# EAGLE design CSB (EAGLE 5.11)
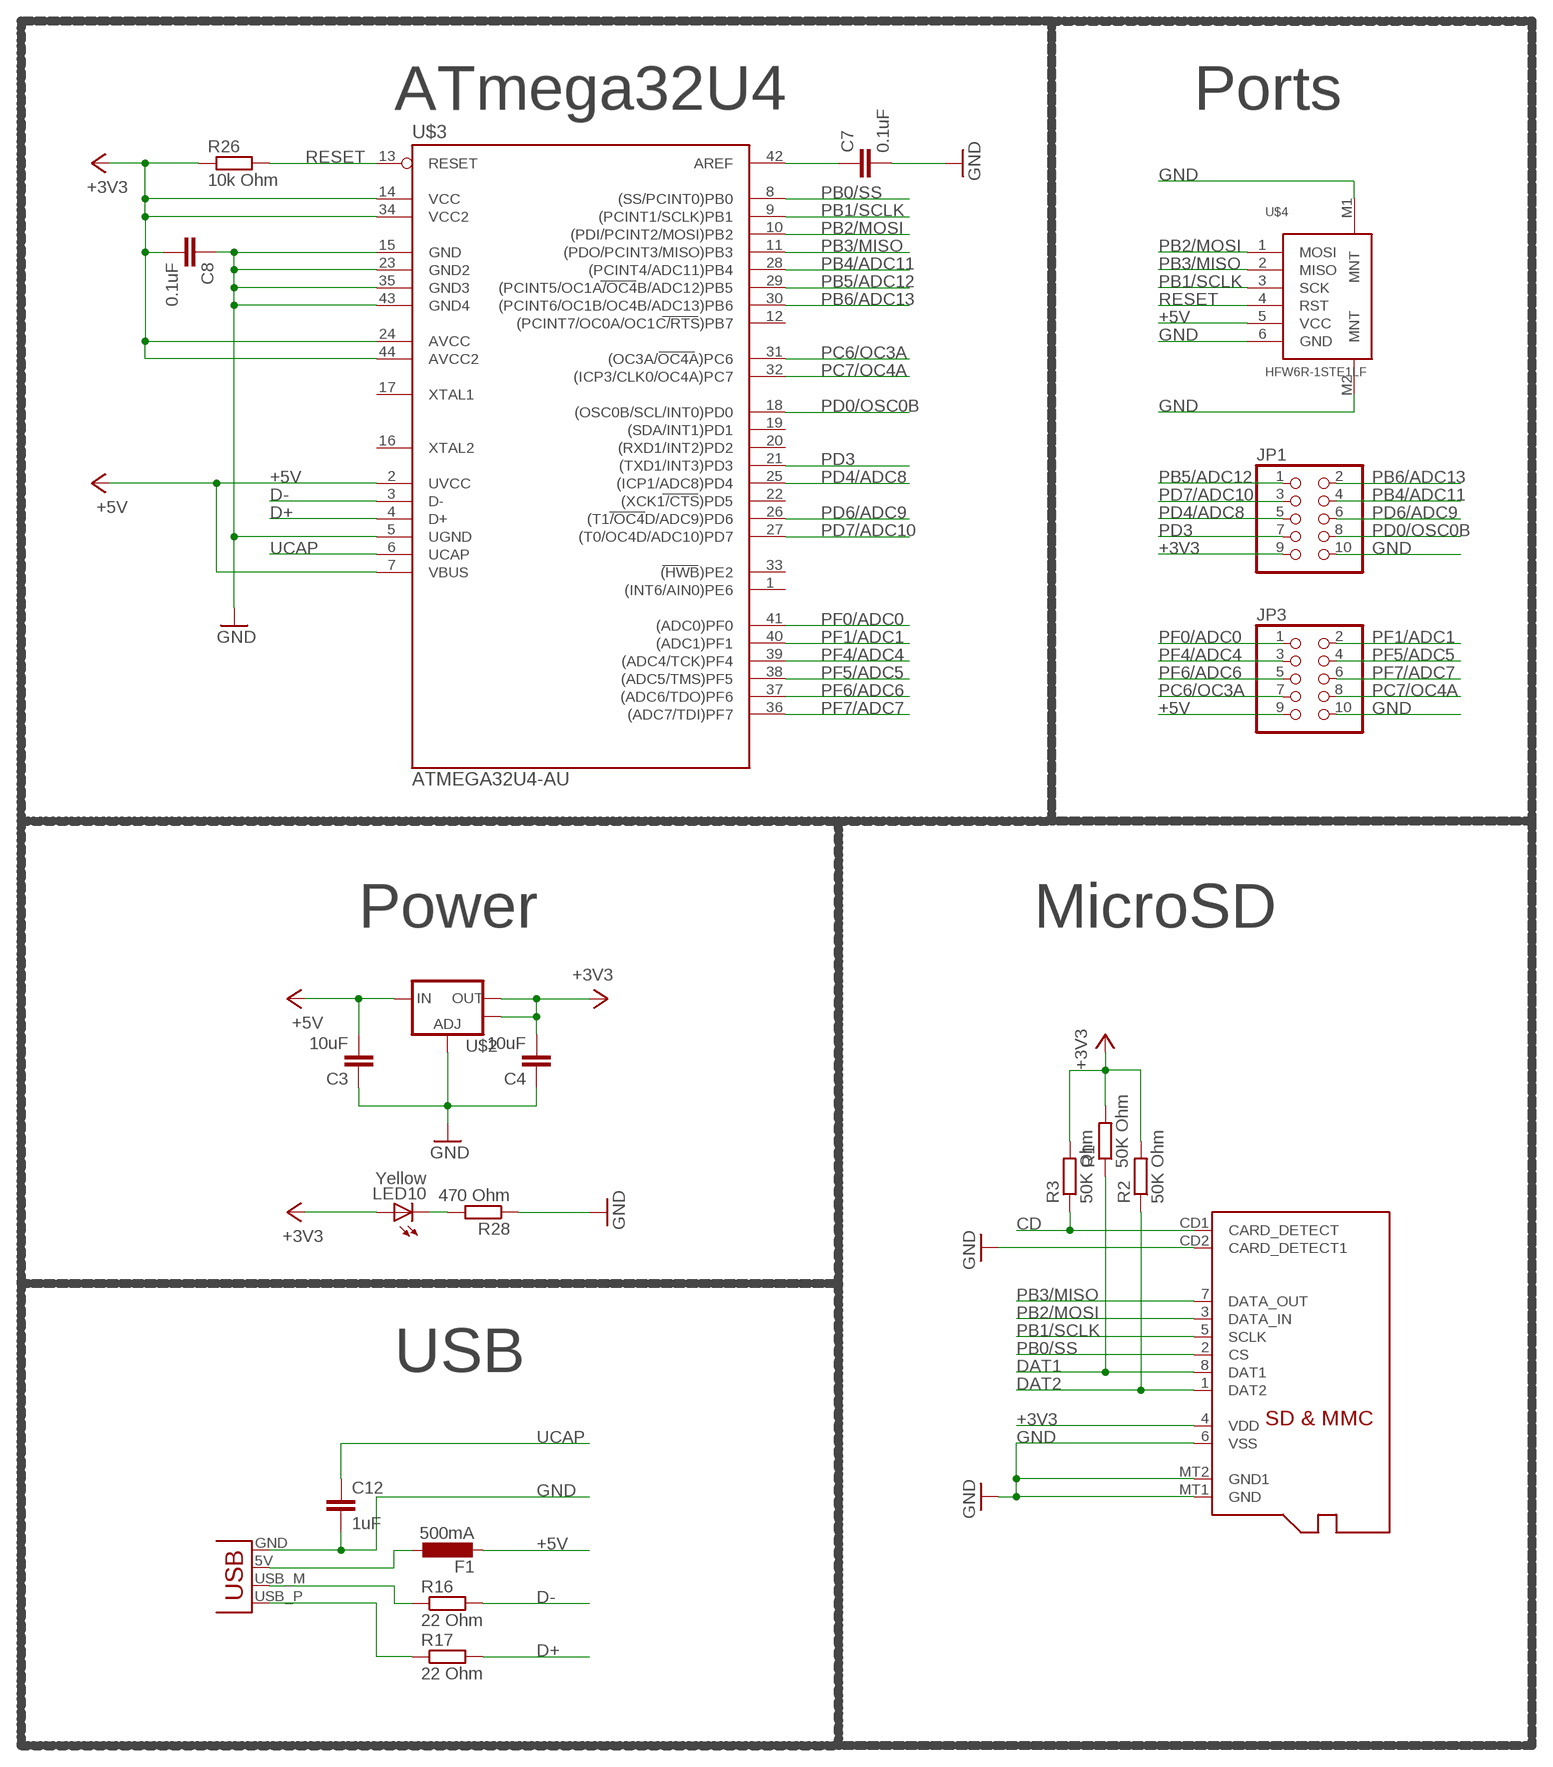
[diagram p0: schematic, sheet 1]

## Parts
C3  10uF  C-EUC0603  [C0603]
C4  10uF  C-EUC0603  [C0603]
C7  0.1uF  C-EUC0603  [C0603]
C8  0.1uF  C-EUC0603  [C0603]
C12  1uF  C-EUC0603  [C0603]
F1  500mA  L-EUL1812  [L1812]
JP1  PINHD-2X5  [2X05]
JP3  PINHD-2X5  [2X05]
LED10  Yellow  LEDCHIPLED_0603  [CHIPLED_0603]
R1  50K Ohm  R-EU_R0603  [R0603]
R2  50K Ohm  R-EU_R0603  [R0603]
R3  50K Ohm  R-EU_R0603  [R0603]
R16  22 Ohm  R-EU_R0603  [R0603]
R17  22 Ohm  R-EU_R0603  [R0603]
R26  10k Ohm  R-EU_R0603  [R0603]
R28  470 Ohm  R-EU_R0603  [R0603]
U$1  MICROSD  [MICROSD]
U$2  V_REG_317SMD  V_REG_LM1117SOT223  [SOT223]
U$3  ATMEGA32U4-AU  [TQFP44]
U$4  HFW6R-1STE1LF  [HFW6R-1STE1LF]
X1  USBPCB  [USB-A-PCB]

## Nets
+3V3: C4.2 C8.2 JP1.9 LED10.A R1.2 R2.2 R3.2 R26.1 U$1.4(VDD) U$2.2(OUT) U$2.4(OUT) U$3.14(VCC) U$3.24(AVCC) U$3.34(VCC2) U$3.44(AVCC2)
+5V: C3.2 F1.2 JP3.9 U$2.3(IN) U$3.2(UVCC) U$3.7(VBUS) U$4.5(VCC)
CD: R3.1 U$1.CD1(CARD_DETECT)
D+: R17.2 U$3.4(D+)
D-: R16.2 U$3.3(D-)
DAT1: R1.1 U$1.8(DAT1)
DAT2: R2.1 U$1.1(DAT2)
GND: C3.1 C4.1 C7.2 C8.1 C12.2 JP1.10 JP3.10 R28.1 U$1.6(VSS) U$1.CD2(CARD_DETECT1) U$1.MT1(GND) U$1.MT2(GND1) U$2.1(ADJ) U$3.5(UGND) U$3.15(GND) U$3.23(GND2) U$3.35(GND3) U$3.43(GND4) U$4.6(GND) U$4.M1(MNT) U$4.M2(MNT) X1.GND
N$5: C7.1 U$3.42(AREF)
N$59: LED10.C R28.2
PB0/SS: U$1.2(CS) U$3.8((SS/PCINT0)PB0)
PB1/SCLK: U$1.5(SCLK) U$3.9((PCINT1/SCLK)PB1) U$4.3(SCK)
PB2/MOSI: U$1.3(DATA_IN) U$3.10((PDI/PCINT2/MOSI)PB2) U$4.1(MOSI)
PB3/MISO: U$1.7(DATA_OUT) U$3.11((PDO/PCINT3/MISO)PB3) U$4.2(MISO)
PB4/ADC11: JP1.4 U$3.28((PCINT4/ADC11)PB4)
PB5/ADC12: JP1.1 U$3.29((PCINT5/OC1A/OC4B/ADC12)PB5)
PB6/ADC13: JP1.2 U$3.30((PCINT6/OC1B/OC4B/ADC13)PB6)
PC6/OC3A: JP3.7 U$3.31((OC3A/OC4A)PC6)
PC7/OC4A: JP3.8 U$3.32((ICP3/CLK0/OC4A)PC7)
PD0/OSC0B: JP1.8 U$3.18((OSC0B/SCL/INT0)PD0)
PD3: JP1.7 U$3.21((TXD1/INT3)PD3)
PD4/ADC8: JP1.5 U$3.25((ICP1/ADC8)PD4)
PD6/ADC9: JP1.6 U$3.26((T1/OC4D/ADC9)PD6)
PD7/ADC10: JP1.3 U$3.27((T0/OC4D/ADC10)PD7)
PF0/ADC0: JP3.1 U$3.41((ADC0)PF0)
PF1/ADC1: JP3.2 U$3.40((ADC1)PF1)
PF4/ADC4: JP3.3 U$3.39((ADC4/TCK)PF4)
PF5/ADC5: JP3.4 U$3.38((ADC5/TMS)PF5)
PF6/ADC6: JP3.5 U$3.37((ADC6/TDO)PF6)
PF7/ADC7: JP3.6 U$3.36((ADC7/TDI)PF7)
RD+: R17.1 X1.USB_P(D+)
RD-: R16.1 X1.USB_M(D-)
RESET: R26.2 U$3.13(RESET) U$4.4(RST)
UCAP: C12.1 U$3.6(UCAP)
VCCBUS: F1.1 X1.5V(VBUS)
Unconnected: U$3.1((INT6/AIN0)PE6) U$3.12((PCINT7/OC0A/OC1C/RTS)PB7) U$3.16(XTAL2) U$3.17(XTAL1) U$3.19((SDA/INT1)PD1) U$3.20((RXD1/INT2)PD2) U$3.22((XCK1/CTS)PD5) U$3.33((HWB)PE2)

## Notes on the sheet
- ATmega32U4 | Ports
- Power | MicroSD
- USB

## Library data of the parts
C3 C4 C7 C8 C12 = rcl:C-EU: CAPACITOR, European symbol
F1 = rcl:L-EU: INDUCTOR, European symbol
JP1 JP3 = pinhead:PINHD-2X5: PIN HEADER
LED10 = adafruit:LED: LED OSRAM: - CHIPLED LG R971, LG N971, LY N971, LG Q971, LY Q971, LO R971, LY R971 LH N974, LH R974 LS Q976, LO Q976, LY Q976 LO Q996 - Hyper CHIPLED LW Q18S LB Q993, LB Q99A, LB R99A - SideLED LS A670, LO A670, LY A670, LG A670, LP A670 LB A673, LV A673, LT A673, LW A673 LH A674 LY A675 LS A676, LA A676, LO A676, LY A676, LW A676 LS A679, LY A679, LG A679 - Hyper Micro SIDELED® LS Y876, LA Y876, LO Y876, LY Y876 LT Y87S - SmartLED LW L88C, LW L88S LB L89C, LB L89S, LG L890 LS L89K, LO L89K, LY L89K LS L896, LA L896, LO L896, LY L896 - TOPLED LS T670, LO T670, LY T670, LG T670, LP T670 LSG T670, LSP T670, LSY T670, LOP T670, LYG T670 LG T671, LOG T671, LSG T671 LB T673, LV T673, LT T673, LW T673 LH T674 LS T676, LA T676, LO T676, LY T676, LB T676, LH T676, LSB T676, LW T676 LB T67C, LV T67C, LT T67C, LS T67K, LO T67K, LY T67K, LW E67C LS E67B, LA E67B, LO E67B, LY E67B, LB E67C, LV E67C, LT E67C LW T67C LS T679, LY T679, LG T679 LS T770, LO T770, LY T770, LG T770, LP T770 LB T773, LV T773, LT T773, LW T773 LH T774 LS E675, LA E675, LY E675, LS T675 LS T776, LA T776, LO T776, LY T776, LB T776 LHGB T686 LT T68C, LB T68C - Hyper Mini TOPLED® LB M676 - Mini TOPLED Santana® LG M470 LS M47K, LO M47K, LY M47K Source: http://www.osram.convergy.de/
R1-R3 R16 R17 R26 R28 = rcl:R-EU_: RESISTOR, European symbol
U$1 = Sparky:MICROSD: Micro-SD / Transflash card holder with SPI pinout For the 3M # 2908-05WB-MG and/or 4UCON #19656 push-push type
U$2 = SparkFun:V_REG_LM1117: Voltage Regulator LM1117 Standard adjustable voltage regulator but in SMD form. Spark Fun Electronics SKU : COM-00595
U$3 = Sparky:ATMEGA32U4-AU
U$4 = con-fci:HFW6R-1STE1LF
X1 = SparkFun:USB: USB Connectors USB-B-PTH is fully proven SKU : PRT-00139 USB-miniB is fully proven SKU : PRT-00587 USB-A-PCB is untested. USB-A-H is throughly reviewed, but untested. Spark Fun Electronics SKU : PRT-00437 USB-B-SMT is throughly reviewed, but untested. Needs silkscreen touching up. USB-A-S has not been used/tested USB-MB-H has not been used/tested

## Board
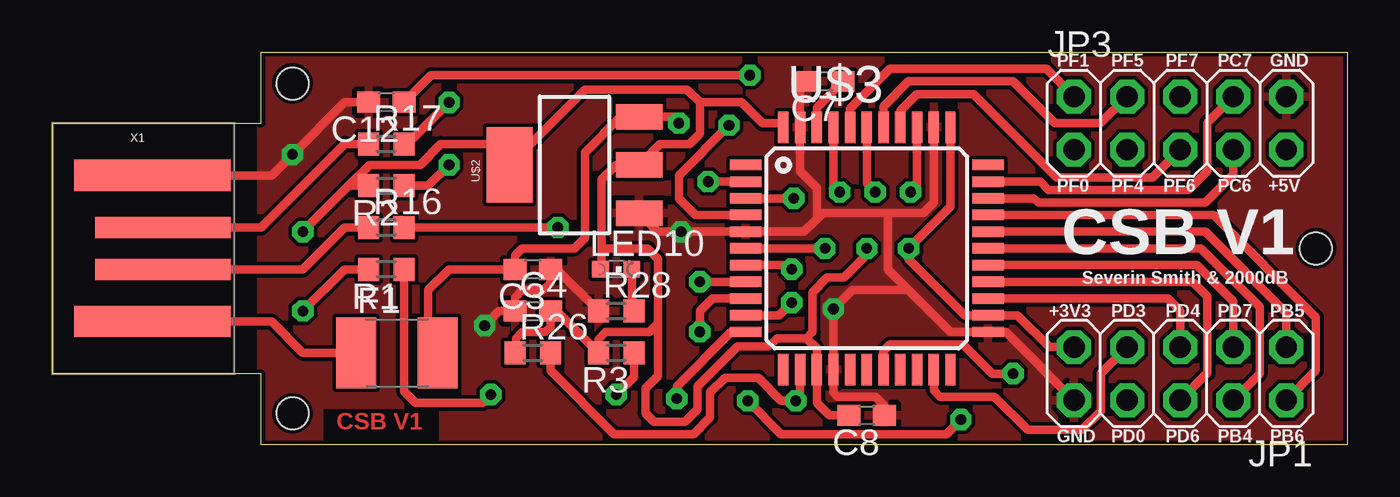
[diagram p1: board, top side]
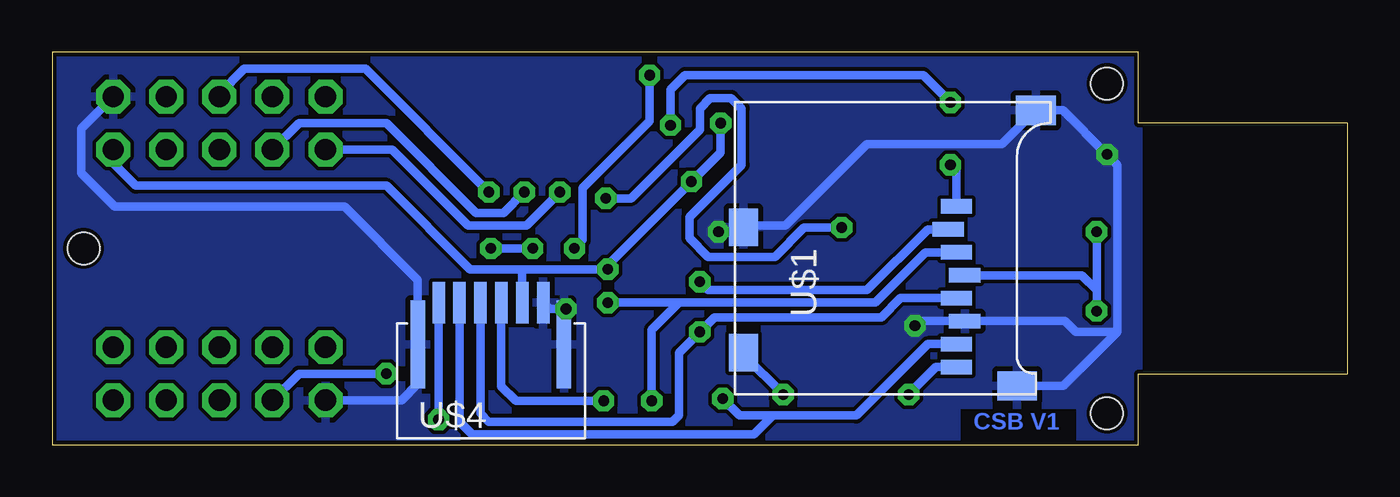
[diagram p2: board, bottom side, seen from below]

Size 62 x 18.8 mm. Coordinates in mm from the lower left corner, seen from the top.
Outline: 0,15.4 10,15.4 10,18.8 62,18.8 62,0 10,0 10,3.4 0,3.4 0,15.4
Copper layers (1*16): Top 0.035mm / dielectric 1.5mm / Bottom 0.035mm
Design rules "APC *": minimum track width 7mil, minimum drill 20mil, track to track 7mil, track to pad 7mil, pad to pad 7mil, via to via 7mil, smd to smd 0mil, copper to edge 8mil, drill to drill 8mil, minimum pad ring 12mil, minimum via ring 10mil, stop-mask expansion 4mil, vias tented up to drill 25mil, thermal gap 10mil
Holes 1.52 mm at 11.5,17.3 11.5,1.5 60.5,9.4
tRestrict: area 13,0.4 to 18.5,1.7
bRestrict: area 13,0.4 to 18.5,1.7

### Footprints (pad centres in the part's own frame; a part is rotated, then mirrored left to right if it is on the bottom)
C0603 = smd 1.1 x 1: 1 -0.85,0; 2 0.85,0
L1812 = smd 1.9 x 3.4: 1 -1.95,0; 2 1.95,0
2X05 = drill 1.016 octagon: 1 -5.08,-1.27; 2 -5.08,1.27; 3 -2.54,-1.27; 4 -2.54,1.27; 5 0,-1.27; 6 0,1.27; 7 2.54,-1.27; 8 2.54,1.27; 9 5.08,-1.27; 10 5.08,1.27
CHIPLED_0603 = smd 0.8 x 0.8: A 0,-0.75; C 0,0.75
R0603 = smd 1 x 1.1: 1 -0.85,0; 2 0.85,0
MICROSD = smd 0.7 x 1.5: 1 2.015,-4.29; 2 0.915,-3.89; 3 -0.185,-4.29; 4 -1.285,-4.69; 5 -2.385,-4.29; 6 -3.485,-4.69; 7 -4.585,-4.29; 8 -5.685,-4.29 | smd 1.8 x 1.4: CD1 -4.985,5.91; CD2 1.015,5.91 | smd 1.4 x 1.9: MT1 -6.585,-7.19; MT2 6.615,-8.09
SOT223 = smd 1.219 x 2.235: 1 -2.311,-3.099; 2 0,-3.099; 3 2.311,-3.099 | smd 3.6 x 2.2: 4 0,3.099
TQFP44 = smd 1.5 x 0.5: 1 -5.8,4; 2 -5.8,3.2; 3 -5.8,2.4; 4 -5.8,1.6; 5 -5.8,0.8; 6 -5.8,0; 7 -5.8,-0.8; 8 -5.8,-1.6; 9 -5.8,-2.4; 10 -5.8,-3.2; 11 -5.8,-4; 23 5.8,-4; 24 5.8,-3.2; 25 5.8,-2.4; 26 5.8,-1.6; 27 5.8,-0.8; 28 5.8,0; 29 5.8,0.8; 30 5.8,1.6; 31 5.8,2.4; 32 5.8,3.2; 33 5.8,4 | smd 0.5 x 1.5: 12 -4,-5.8; 13 -3.2,-5.8; 14 -2.4,-5.8; 15 -1.6,-5.8; 16 -0.8,-5.8; 17 0,-5.8; 18 0.8,-5.8; 19 1.6,-5.8; 20 2.4,-5.8; 21 3.2,-5.8; 22 4,-5.8; 34 4,5.8; 35 3.2,5.8; 36 2.4,5.8; 37 1.6,5.8; 38 0.8,5.8; 39 0,5.8; 40 -0.8,5.8; 41 -1.6,5.8; 42 -2.4,5.8; 43 -3.2,5.8; 44 -4,5.8
HFW6R-1STE1LF = smd 0.6 x 2: 1 -2,0; 2 -1,0; 3 0,0; 4 1,0; 5 2,0; 6 3,0 | smd 0.7 x 4.2: M1 -3,-2; M2 4,-2
USB-A-PCB = smd 7.5 x 1.5: 5V -0.2,-3.5; GND -0.2,3.5 | smd 6.5 x 1: USB_M 0.3,-1; USB_P 0.3,1

### Placement (x,y rotation side)
C3  23,8.4 180 top
C4  23,6.4 0 top
C7  37,17.4 180 top
C8  39,1.4 180 top
C12  16,16.4 180 top
F1  16.5,4.4 0 top
JP1  54,3.4 180 top
JP3  54,15.4 0 top
LED10  27,8.4 270 top
R1  16,8.4 180 top
R2  16,12.4 180 top
R3  27,4.4 180 top
R16  16,10.4 0 top
R17  16,14.4 0 top
R26  23,4.4 0 top
R28  27,6.4 0 top
U$1  23,9.4 90 bottom
U$2  25,13.4 90 top
U$3  39,9.4 0 top
U$4  41.5,6.8 0 bottom
X1  5,9.4 0 top

### Tracks (layer width: path | path; a pad name or v marks a point on that pad's centre or on a via)
+3V3  (via drill 0.51)
  Top 0.406: 14.2,12.4 R2.2 | v12,10.2 14.2,12.4 | v12,6.4 14,8.4 R1.2 | 14.2,12.4 15.2,13.4 17.6,13.4 18.6,14.4 20.9,14.4 U$2.4 25.5,17 30.4,17 31,16.4 | LED10.A 26.3,8.45 26.3,9.4 | 26.3,9.4 26.3,12.7 27,13.4 U$2.2 | 29,5.8 28.6,5.4 26.5,5.4 26.15,5.05 R3.2 24.15,6.4 C4.2 23.85,5.65 23.6,5.4 22.5,5.4 22.2,5.1 22.2,4.45 R26.1 | 29,5.8 29,8.9 28.5,9.4 26.3,9.4 | U$2.2 27.7,13.4 | U$2.2 29.1,14.4 30.5,14.4 31,14.9 31,16.4 | 31,16.4 33,16.4 34,15.4 35,15.4 U$3.44 | JP1.9 47.73,4.67 46.2,6.2 U$3.24 43.7,6.2 41,8.9 v41,9.4 43,11.4 U$3.34 | 29,5.8 29,3.3 28.4,2.7 28.4,1.5 28.8,1.1 30.3,1.1 30.9,1.7 30.9,2.8 32.8,4.7 34.3,4.7 34.7,5.1 36.1,5.1 | 36.1,5.1 36.6,4.6 U$3.14 36.6,2 37.2,1.4 C8.2 38,1.4 | 36.1,5.1 36.4,5.4 36.4,7.3 37.1,8 37.9,8 39,9.1 v39,9.4
  Bottom 0.406: v12,6.4 12,7.4 | 12,7.4 v12,10.2 | U$1.4 12.71,8.12 12,7.4 | v39,9.4 v41,9.4
+5V  (via drill 0.51)
  Top 0.406: 18.45,5.85 F1.2 18,4.85 18,7.4 19,8.4 C3.2 22.15,9.05 22.5,9.4 25,9.4 25.5,9.9 25.5,14 27.21,15.71 U$2.3 29.69,15.71 v30,15.4 | v31.4,12.6 U$3.2 | U$3.7 35.2,8.6 v35.4,8.4
  Bottom 0.406: JP3.9 59.08,13.48 58,12.4 46,12.4 42,8.4 39.5,8.4 | v30,15.4 30,14 v31.4,12.6 35.4,8.6 v35.4,8.4 39.5,8.4 | 39.5,8.4 U$4.5
CD  (via drill 0.51)
  Top 0.406: R3.1 27.85,3.25 v27,2.4
  Bottom 0.406: v27,2.4 28.91,4.31 U$1.CD1
D+  (via drill 0.51)
  Top 0.406: R17.2 17,14.4 v19,16.4 | v32.4,15.3 30,12.9 30,11.8 30.8,11 U$3.4
  Bottom 0.406: v19,16.4 20.3,17.7 31.7,17.7 32.4,17 v32.4,15.3
D-  (via drill 0.51)
  Top 0.406: R16.2 v24.2,10.4 | v35.5,11.8 U$3.3
  Bottom 0.406: v35.5,11.8 34.3,11.8 31,15.1 31,16.1 30.5,16.6 29.5,16.6 29,16.1 29,13.4 31.5,10.9 31.5,9.9 30.6,9 27.4,9 26,10.4 v24.2,10.4
DAT1  (via drill 0.51)
  Top 0.406: R1.1 16.85,2.55 17.4,2 20.6,2 v21,2.4
  Bottom 0.406: U$1.8 19.68,3.71 v21,2.4
DAT2  (via drill 0.51)
  Top 0.406: R2.1 18,12.4 v19,13.4
  Bottom 0.406: v19,13.4 18.71,13.11 U$1.1
GND  (via drill 0.51)
  Top 0.406: X1.GND 10.5,12.9 v11.5,13.9 14,16.4 C12.2 | R28.1 24.15,8.4 C3.1 23.85,7.75 23.5,7.4 22.5,7.4 22.15,7.05 C4.1 21.4,6.4 v20.7,5.7 | U$2.1 28.99,10.2 v30.1,10.2 U$3.5 36,10.2 36.6,10.8 | 36.6,10.8 36.6,12.3 35.8,13.1 U$3.43 35.8,17.05 C7.2 | JP1.10 45.65,5.4 U$3.23 43,5.4 41,7.4 | 36.6,10.8 36.9,11.1 40,11.1 | 40,11.1 41.7,11.1 42.2,11.6 U$3.35 | 40,11.1 40,8.4 41,7.4 | 41,7.4 38.3,7.4 v37.4,6.5 U$3.15 37.4,2.5 37.6,2.3 39.4,2.3 39.85,1.85 C8.1
  Bottom 0.406: U$1.MT1 13.59,2.81 11,5.4 | 11,5.4 11,13.4 v11.5,13.9 13.62,16.02 U$1.MT2 16.52,14.4 23,14.4 26.89,10.51 29,10.51 U$1.CD2 29.12,10.2 v30.1,10.2 | 11,5.4 13,5.4 13.52,5.92 U$1.6 20.48,5.92 v20.7,5.7 | JP3.10 60.6,15.15 60.6,13 59,11.4 48,11.4 44.5,7.9 U$4.M1 44.5,2.9 45.27,2.13 JP1.10 | 37.5,3.9 U$4.M2 37.5,6.4 v37.4,6.5 38.2,6.5 U$4.6
  pour Bottom: 10,18.8 62,18.8 62,0 10,0
  pour Top: 10,18.8 62,18.8 62,0 10,0
N$5
  Top 0.406: U$3.42 36.6,16.15 C7.1
N$59
  Top 0.406: LED10.C 27.75,6.5 R28.2
PB0/SS  (via drill 0.51)
  Top 0.406: v31,7.8 U$3.8
  Bottom 0.406: U$1.2 20.09,10.31 23,7.4 30.6,7.4 v31,7.8
PB1/SCLK  (via drill 0.51)
  Top 0.406: v31,5.4 31,6.4 31.6,7 U$3.9
  Bottom 0.406: U$1.5 21.39,7.02 22.3,6.1 30.3,6.1 v31,5.4 32,4.4 32,1.4 32.3,1.1 41.1,1.1 41.5,1.5 U$4.3
PB2/MOSI  (via drill 0.51)
  Top 0.406: v43.5,1.2 42.8,0.5 34.9,0.5 v33.3,2.1 | U$3.10 34.8,6.2 v35.4,6.8
  Bottom 0.406: U$1.3 20.18,9.21 22.6,6.8 32,6.8 | 32,6.8 v35.4,6.8 | v43.5,1.2 U$4.1 | v33.3,2.1 33.3,5.5 32,6.8
PB3/MISO  (via drill 0.51)
  Top 0.406: U$3.11 33,5.4 | U$3.11 33.1,5.4 | v29.9,2.2 29.9,2.8 32.5,5.4 U$3.11
  Bottom 0.406: U$1.7 20.09,4.81 23.5,1.4 27.5,1.4 | U$4.2 42.5,1.1 41.9,0.5 28.4,0.5 27.5,1.4 | 27.5,1.4 29.1,1.4 v29.9,2.2
PB4/ADC11
  Top 0.406: U$3.28 55,9.4 57.8,6.6 57.8,3.39 JP1.4
PB5/ADC12
  Top 0.406: U$3.29 55.2,10.2 59.08,6.32 JP1.1
PB6/ADC13
  Top 0.406: U$3.30 55.6,11 60.5,6.1 60.5,3.55 JP1.2
PC6/OC3A
  Top 0.406: U$3.31 47,11.8 47.2,11.6 55.2,11.6 56.54,12.94 JP3.7
PC7/OC4A
  Top 0.406: U$3.32 47.3,12.6 47.7,12.2 54.4,12.2 55.3,13.1 55.3,15.43 JP3.8
PD0/OSC0B  (via drill 0.51)
  Top 0.406: U$3.18 39.8,4.5 40.1,4.8 43.6,4.8 45,3.4 v46,3.4
  Bottom 0.406: v46,3.4 50.19,3.4 JP1.8
PD3
  Top 0.406: U$3.21 42.2,2.6 42.5,2.3 45.1,2.3 46.7,0.7 49.3,0.7 50.2,1.6 50.2,3.41 JP1.7
PD4/ADC8
  Top 0.406: U$3.25 53.4,7 54,6.4 JP1.5
PD6/ADC9
  Top 0.406: U$3.26 54.6,7.8 55.3,7.1 55.3,3.43 JP1.6
PD7/ADC10
  Top 0.406: U$3.27 54.8,8.6 56.54,6.86 JP1.3
PF0/ADC0  (via drill 0.51)
  Top 0.406: U$3.41 37.4,12.4 v37.7,12.1
  Bottom 0.406: v37.7,12.1 39.3,10.5 42.1,10.5 45.73,14.13 JP3.1
PF1/ADC1
  Top 0.406: JP3.2 47.59,18 40.1,18 38.2,16.1 U$3.40
PF4/ADC4  (via drill 0.51)
  Top 0.406: U$3.39 39,12.5 v39.4,12.1
  Bottom 0.406: JP3.3 50.19,15.4 46,15.4 41.7,11.1 40.4,11.1 v39.4,12.1
PF5/ADC5
  Top 0.406: U$3.38 39.8,16.2 41,17.4 46,17.4 48,15.4 50.19,15.4 JP3.4
PF6/ADC6
  Top 0.406: U$3.37 40.6,16 41.4,16.8 44.1,16.8 48.1,12.8 52.67,12.8 JP3.5
PF7/ADC7  (via drill 0.51)
  Top 0.406: U$3.36 41.4,12.4 v41.1,12.1
  Bottom 0.406: JP3.6 54,16.8 52.8,18 47,18 v41.1,12.1
RD+
  Top 0.406: R17.1 14,14.4 10,10.4 X1.USB_P
RD-
  Top 0.406: X1.USB_M 12,8.4 14,10.4 R16.1
RESET  (via drill 0.51)
  Top 0.406: R26.2 23.85,3.55 26.9,0.5 30.7,0.5 31.5,1.3 31.5,2.5 32.2,3.2 33.8,3.2 34.9,2.1 v35.6,2.1 35.8,2.3 U$3.13
  Bottom 0.406: U$4.4 40.5,2.8 39.8,2.1 v35.6,2.1
UCAP  (via drill 0.51)
  Top 0.406: C12.1 18.15,17.7 v33.4,17.7 | v37,9.4 U$3.6
  Bottom 0.406: v33.4,17.7 33.4,15.5 36.6,12.3 36.6,9.8 v37,9.4
VCCBUS
  Top 0.406: X1.5V 10.5,5.9 12,4.4 F1.1

### Text on the board
Top: CSB V1
Bottom: CSB V1
_tsilk: PF1 | PF5 | PF7 | PC7 | GND | PF0 | PF4 | PF6 | PC6 | +5V | CSB V1 | Severin Smith & 2000dB | +3V3 | PD3 | PD4 | PD7 | PB5 | GND | PD0 | PD6 | PB4 | PB6